# EAGLE design Lighting_Board (EAGLE 7.2.0)
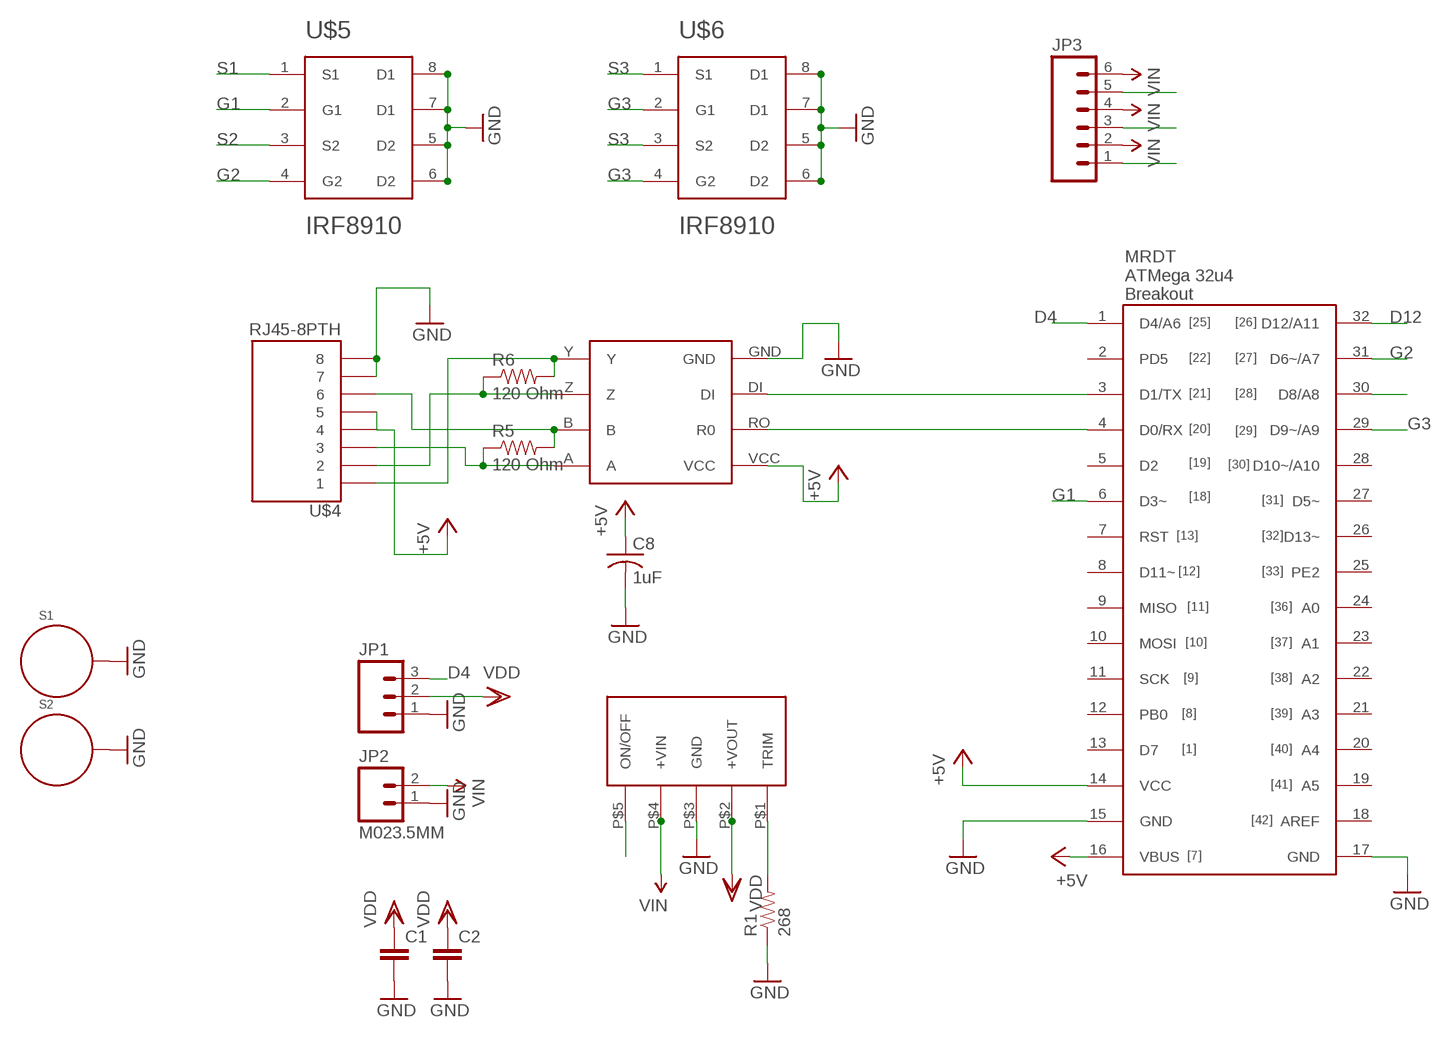
[diagram p0: schematic, sheet 1]

## Parts
C1  CAP1206  [1206]
C2  CAP1206  [1206]
C8  1uF  C-USC1206  [C1206]
JP1  M03SCREW  [SCREWTERMINAL-3.5MM-3]
JP2  M023.5MM  [SCREWTERMINAL-3.5MM-2]
JP3  M063.5MM-6  [SCREWTERMINAL-3.5MM-6]
R1  268  RESISTOR1206  [1206]
R5  120 Ohm  RESISTOR1206  [1206]
R6  120 Ohm  RESISTOR1206  [1206]
S1  STANDOFF_ELECTRICAL  [STANDOFF-ELECTRICAL]
S2  STANDOFF_ELECTRICAL  [STANDOFF-ELECTRICAL]
U$1  OKR-T/10-W12-C  [OKR-T/10-W12-C]
U$2  32U4_BREAKOUT  [32U4_MCU_DIP]
U$3  MAX3077  [MAX3070E]
U$4  RJ45-8PTH  [RJ45-8]
U$5  IRF8910  [SO8]
U$6  IRF8910  [SO8]

## Nets
+5V: C8.1 U$2.14(VCC) U$2.16(VBUS) U$3.VCC U$4.4 U$4.5
D4: JP1.3 U$2.1(D4/A6)
D8: U$1.P$5(ON/OFF) U$2.30(D8/A8)
D12: U$2.32(D12/A11)
G1: U$2.6(D3~) U$5.2(G1)
G2: U$2.31(D6~/A7) U$5.4(G2)
G3: U$2.29(D9~/A9) U$6.2(G1) U$6.4(G2)
GND: C1.2 C2.2 C8.2 JP1.1 JP2.1 R1.1 S1.P1 S2.P1 U$1.P$3(GND) U$2.15(GND) U$2.17(GND) U$3.GND U$4.7 U$4.8 U$5.5(D2) U$5.6(D2) U$5.7(D1) U$5.8(D1) U$6.5(D2) U$6.6(D2) U$6.7(D1) U$6.8(D1)
N$1: R1.2 U$1.P$1(TRIM)
N$12: R6.2 U$3.Y U$4.1
N$18: R6.1 U$3.Z U$4.2
N$19: R5.2 U$3.B U$4.6
N$20: R5.1 U$3.A U$4.3
N$21: U$2.3(D1/TX) U$3.DI
RXD: U$2.4(D0/RX) U$3.RO(R0)
S1: JP3.5 U$5.1(S1)
S2: JP3.3 U$5.3(S2)
S3: JP3.1 U$6.1(S1) U$6.3(S2)
VDD: C1.1 C2.1 JP1.2 U$1.P$2(+VOUT)
VIN: JP2.2 JP3.2 JP3.4 JP3.6 U$1.P$4(+VIN)
Unconnected: U$2.2(PD5) U$2.5(D2) U$2.7(RST) U$2.8(D11~) U$2.9(MISO) U$2.10(MOSI) U$2.11(SCK) U$2.12(PB0) U$2.13(D7) U$2.18(AREF) U$2.19(A5) U$2.20(A4) U$2.21(A3) U$2.22(A2) U$2.23(A1) U$2.24(A0) U$2.25(PE2) U$2.26(D13~) U$2.27(D5~) U$2.28(D10~/A10)

## Library data of the parts
C1 C2 = SparkFun-Capacitors:CAP: Capacitor Standard 0603 ceramic capacitor, and 0.1" leaded capacitor.
C8 = resistor:C-US: CAPACITOR, American symbol
JP1 = SparkFun-Connectors:M03: Header 3 Standard 3-pin 0.1" header. Use with straight break away headers (SKU : PRT-00116), right angle break away headers (PRT-00553), swiss pins (PRT-00743), machine pins (PRT-00117), and female headers (PRT-00115). Molex polarized connector foot print use with SKU : PRT-08232 with associated crimp pins and housings.
JP2 = SparkFun-Connectors:M02: Standard 2-pin 0.1" header. Use with - straight break away headers ( PRT-00116) - right angle break away headers (PRT-00553) - swiss pins (PRT-00743) - machine pins (PRT-00117) - female headers (PRT-00115) Molex polarized connector foot print use with: PRT-08233 with associated crimp pins and housings. 2.54_SCREWTERM for use with PRT-10571. 3.5mm Screw Terminal footprints for PRT-08084 5mm Screw Terminal footprints for use with PRT-08432
JP3 = SparkFun-Connectors:M06: Header 6 Standard 6-pin 0.1" header. Use with straight break away headers (SKU : PRT-00116), right angle break away headers (PRT-00553), swiss pins (PRT-00743), machine pins (PRT-00117), and female headers (PRT-00115). Molex polarized connector foot print use with SKU : PRT-08094 with associated crimp pins and housings. NOTES ON THE VARIANTS LOCK and LOCK_LONGPADS... This footprint was designed to help hold the alignment of a through-hole component (i.e. 6-pin header) while soldering it into place. You may notice that each hole has been shifted either up or down by 0.005 of an inch from it's more standard position (which is a perfectly straight line). This slight alteration caused the pins (the squares in the middle) to touch the edges of the holes. Because they are alternating, it causes a "brace" to hold the component in place. 0.005 has proven to be the perfect amount of "off-center" position when using our standard breakaway headers. Although looks a little odd when you look at the bare footprint, once you have a header in there, the alteration is very hard to notice. Also,if you push a header all the way into place, it is covered up entirely on the bottom side. This idea of altering the position of holes to aid alignment will be further integrated into the Sparkfun Library for other footprints. It can help hold any component with 3 or more connection pins.
R1 R5 R6 = SparkFun-Passives:RESISTOR: Resistor Basic schematic elements and footprints for 0603, 1206, and PTH resistors.
S1 S2 = SparkFun-Electromechanical:STANDOFF_ELECTRICAL: A standoff intended to be an electrically connected point. Pad size and stop size allow for a #4 Phillips pan screw head to make a solid connection to the board.
U$1 = MRDT-2015-General:OKR-T/10-W12-C
U$2 = MRDT-2015-General:32U4_BREAKOUT
U$3 = MAX3077:MAX3077
U$4 = SparkFun-Connectors:RJ45-8: RJ45 Jack Simple RJ45, 8-pin connection - connector for common Cat5, Cat5e, and Cat6 Ethernet cables. Footprint not yet proven in production. Connector sku is PRT-00643; Breakout PCB sku is BOB-00716.
U$5 U$6 = MRDT-2015-General:IRF8910

## Board
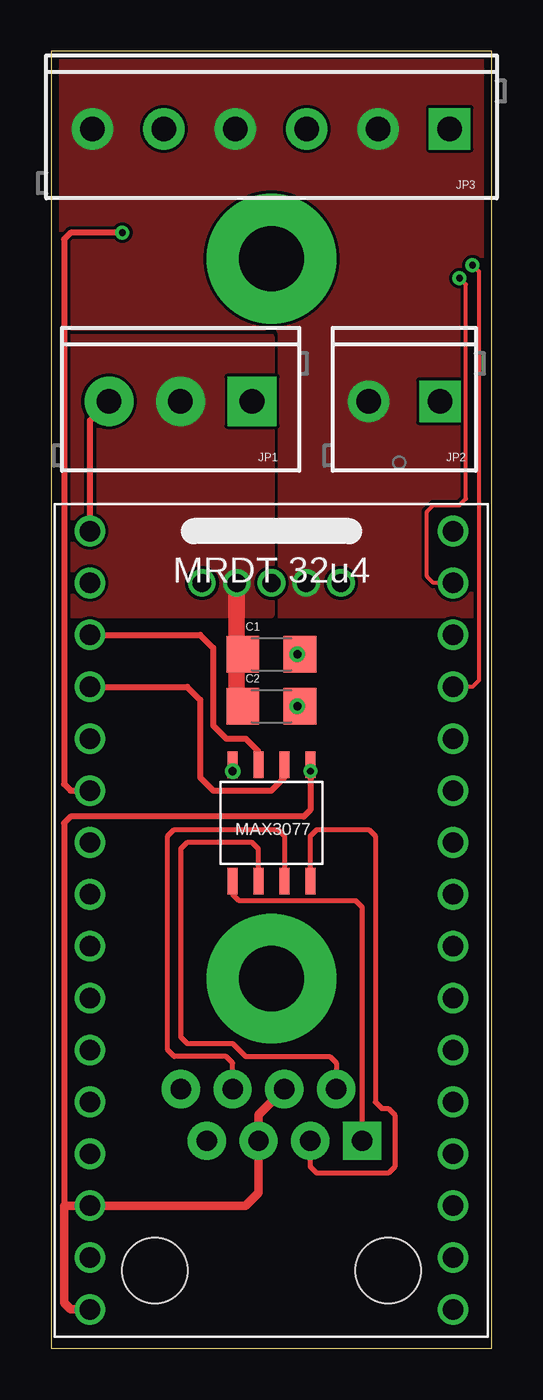
[diagram p1: board, top side]
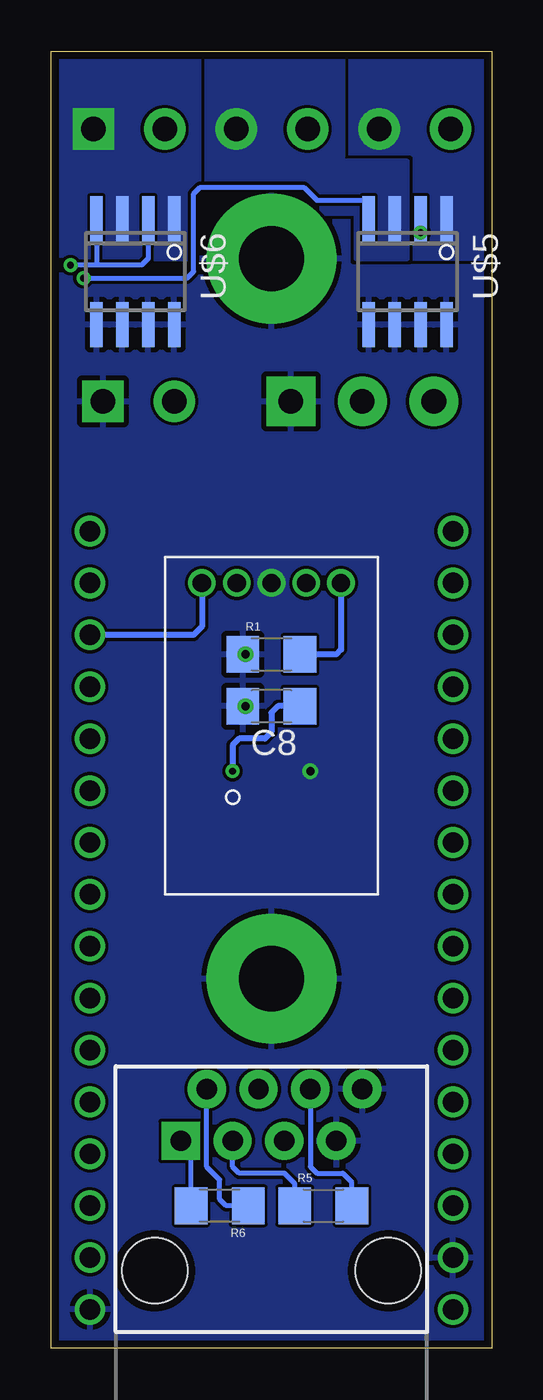
[diagram p2: board, bottom side, seen from below]

Size 21.59 x 63.5 mm. Coordinates in mm from the lower left corner, seen from the top.
Outline: 0,63.5 0,0 21.59,0 21.59,63.5 0,63.5
Copper layers (1*16): Top 0.0356mm / dielectric 1.5011mm / Bottom 0.0356mm
Design rules "OSHPark": minimum track width 6mil, minimum drill 13mil, track to track 6mil, track to pad 6mil, pad to pad 6mil, via to via 6mil, smd to smd 6mil, copper to edge 15mil, drill to drill 6mil, minimum pad ring 7mil, minimum via ring 7mil, stop-mask expansion 3mil, vias tented up to drill 0mil, thermal gap 10mil

### Footprints (pad centres in the part's own frame; a part is rotated, then mirrored left to right if it is on the bottom)
1206 = smd 1.6 x 1.8: 1 -1.4,0; 2 1.4,0
C1206 = smd 1.6 x 1.8: 1 -1.4,0; 2 1.4,0
SCREWTERMINAL-3.5MM-3 = drill 1.2 pad 2.413 square: 1 0,0 | drill 1.2 pad 2.413: 2 3.5,0; 3 7,0
SCREWTERMINAL-3.5MM-2 = drill 1.2 pad 2.032 square: 1 0,0 | drill 1.2 pad 2.032: 2 3.5,0
SCREWTERMINAL-3.5MM-6 = drill 1.2 pad 2.032 square: 1 0,0 | drill 1.2 pad 2.032: 2 3.5,0; 3 7,0; 4 10.5,0; 5 14,0; 6 17.5,0
STANDOFF-ELECTRICAL = drill 3.2 pad 6.35: P1 0,0
OKR-T/10-W12-C = drill 0.9: P$1 -3.404,-7.62; P$2 -1.702,-7.62; P$3 0,-7.62; P$4 1.702,-7.62; P$5 3.404,-7.62
32U4_MCU_DIP = drill 1: 1 -8.89,19.05; 2 -8.89,16.51; 3 -8.89,13.97; 4 -8.89,11.43; 5 -8.89,8.89; 6 -8.89,6.35; 7 -8.89,3.81; 8 -8.89,1.27; 9 -8.89,-1.27; 10 -8.89,-3.81; 11 -8.89,-6.35; 12 -8.89,-8.89; 13 -8.89,-11.43; 14 -8.89,-13.97; 15 -8.89,-16.51; 16 -8.89,-19.05; 17 8.89,-19.05; 18 8.89,-16.51; 19 8.89,-13.97; 20 8.89,-11.43; 21 8.89,-8.89; 22 8.89,-6.35; 23 8.89,-3.81; 24 8.89,-1.27; 25 8.89,1.27; 26 8.89,3.81; 27 8.89,6.35; 28 8.89,8.89; 29 8.89,11.43; 30 8.89,13.97; 31 8.89,16.51; 32 8.89,19.05
MAX3070E = smd 0.49 x 1.3: A -1.905,2.857; B -0.635,2.857; DI 0.635,-2.857; GND 1.905,-2.857; RO -0.635,-2.857; VCC -1.905,-2.857; Y 1.905,2.857; Z 0.635,2.857
RJ45-8 = drill 1 pad 1.88 square: 1 -4.445,6.35 | drill 1 pad 1.88: 2 -3.175,8.89; 3 -1.905,6.35; 4 -0.635,8.89; 5 0.635,6.35; 6 1.905,8.89; 7 3.175,6.35; 8 4.445,8.89 | hole 3.2: -5.715,0; 5.715,0
SO8 = smd 0.6 x 2.2: 1 -1.905,-2.6; 2 -0.635,-2.6; 3 0.635,-2.6; 4 1.905,-2.6; 5 1.905,2.6; 6 0.635,2.6; 7 -0.635,2.6; 8 -1.905,2.6

### Placement (x,y rotation side)
C1  10.79,33.97 0 top
C2  10.79,31.43 0 top
C8  10.79,31.43 180 bottom
JP1  9.84,46.35 180 top
JP2  19.05,46.35 180 top
JP3  19.53,59.69 180 top
R1  10.79,33.97 0 bottom
R5  8.26,6.99 0 bottom
R6  13.34,6.99 180 bottom
S1  10.79,18.1 0 top
S2  10.79,53.34 0 top
U$1  10.79,29.84 180 bottom
U$2  10.79,20.95 0 top
U$3  10.79,25.72 180 top
U$4  10.79,3.81 0 bottom
U$5  4.13,52.7 180 bottom
U$6  17.46,52.7 180 bottom

### Tracks (layer width: path | path; a pad name or v marks a point on that pad's centre or on a via)
+5V  (via drill 0.33)
  Top 0.305: U$3.VCC v12.7,28.26 12.7,26.35 12.38,26.04 0.95,26.04 0.64,25.72 0.64,6.99
  Top 0.406: U$2.16 0.95,1.91 0.64,2.22 0.64,6.99 U$2.14 9.53,6.99 10.16,7.62 U$4.5 10.16,11.43 U$4.4
  Bottom 0.305: C8.1 10.48,31.43 10.79,31.11 10.79,30.16 11.11,29.84 12.38,29.84 12.7,29.53 v12.7,28.26
D4
  Top 0.305: U$2.1 1.91,45.42 JP1.3
D8
  Bottom 0.305: U$1.P$5 14.2,35.33 14.61,34.92 U$2.30
G1  (via drill 0.33)
  Top 0.305: v3.49,54.61 0.95,54.61 0.64,54.29 0.64,27.62 0.95,27.3 U$2.6
  Bottom 0.305: U$5.2 v3.49,54.61
G2  (via drill 0.33)
  Top 0.203: v20,52.39 20.32,52.07 20.32,41.59 20,41.27 18.73,41.27 18.41,40.96 18.41,37.78 18.73,37.47 U$2.31
  Bottom 0.254: v20,52.39 14.92,52.39 14.61,52.7 14.61,56.52 14.29,56.83 9.21,56.83 8.57,56.2 6.03,56.2 U$5.4
G3  (via drill 0.33)
  Top 0.203: U$2.29 20.64,32.38 20.95,32.7 20.95,52.7 v20.64,53.02
  Bottom 0.254: U$6.2 16.83,53.34 17.14,53.02 19.37,53.02 | 19.37,53.02 v20.64,53.02 | U$6.4 19.37,53.02
GND  (via drill 0.41)
  Top 0.305: U$3.GND v8.89,28.26
  Top 0.813: v12.06,31.43 C2.2 | C1.2 v12.06,33.97
  pour Bottom (isolate 0.152, rank 6): -1.27,66.04 23.5,66.04 23.5,-1.27 -1.27,-1.27
  pour Bottom (no thermals): 9.84,36.51 9.84,38.42 11.75,38.42 11.75,36.51
N$1
  Bottom 0.305: U$1.P$1 7.39,34.2 7.62,33.97 R1.2
N$12
  Top 0.254: U$4.1 15.24,21.59 14.92,21.91 9.21,21.91 8.89,22.23 U$3.Y
  Bottom 0.254: R6.2 14.73,9.65 U$4.1
N$18
  Top 0.254: U$3.Z 10.16,24.45 9.84,24.77 6.67,24.77 6.35,24.45 6.35,15.24 6.67,14.92 8.89,14.92 9.53,14.29 13.65,14.29 13.97,13.97 U$4.2
  Bottom 0.254: R6.1 13.02,6.99 13.34,7.3 13.34,8.26 13.97,8.89 U$4.2
N$19
  Top 0.254: U$4.6 8.89,13.97 8.57,14.29 6.03,14.29 5.71,14.61 5.71,25.08 6.03,25.4 11.11,25.4 11.43,25.08 U$3.B
  Bottom 0.254: U$4.6 8.89,8.89 8.57,8.57 7.3,8.57 6.86,8.12 R5.2
N$20
  Top 0.254: U$3.A 12.7,25.08 13.02,25.4 15.56,25.4 15.88,25.08 15.88,12.06 16.19,11.75 16.51,11.75 16.83,11.43 16.83,8.89 16.51,8.57 13.02,8.57 12.7,8.89 U$4.3
  Bottom 0.254: R5.1 9.65,8.07 10.16,8.57 12.38,8.57 12.7,8.89 U$4.3
N$21
  Top 0.305: U$2.3 7.3,34.92 7.94,34.29 7.94,30.48 8.57,29.84 9.53,29.84 10.16,29.21 U$3.DI
RXD
  Top 0.305: U$2.4 6.67,32.38 7.3,31.75 7.3,27.94 7.94,27.3 10.79,27.3 11.43,27.94 U$3.RO
S1
  pour Bottom (rank 2, no thermals): 4.13,53.34 4.13,58.1 7.3,58.1 7.3,63.5 0,63.5 0,53.34
S2
  pour Bottom (no thermals): 4.13,53.34 4.13,58.1 7.3,58.1 7.3,63.5 13.97,63.5 13.97,55.56 6.67,55.56 6.67,53.34
S3
  pour Bottom (rank 2, no thermals): 13.97,53.34 13.97,63.5 21.59,63.5 21.59,53.34
VDD
  Top 0.813: U$1.P$2 9.09,33.67 | C2.1 9.09,31.73 9.09,33.67 | 9.09,33.67 C1.1
  pour Top (no thermals): 0,35.88 0,49.53 10.79,49.53 10.79,35.88
VIN
  pour Top (rank 2, no thermals): 0,49.53 0,63.5 21.59,63.5 21.59,35.88 10.79,35.88 10.79,49.53